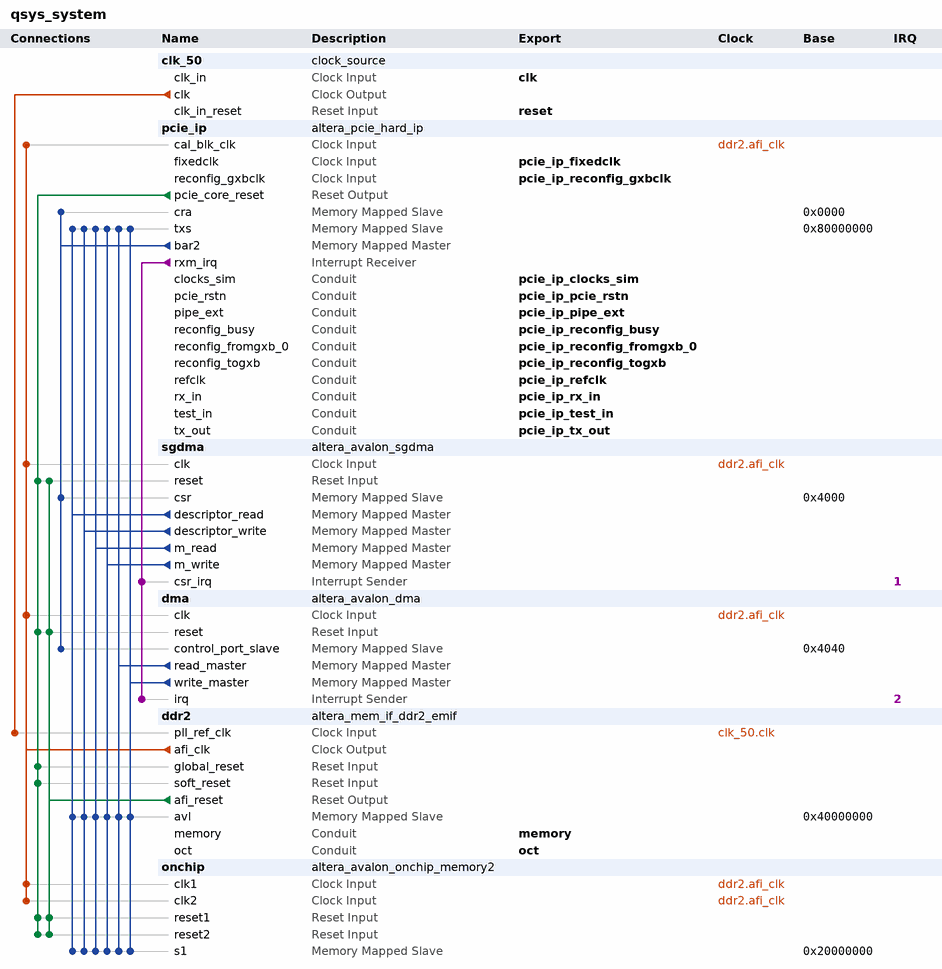
[diagram p0: system contents]
# Platform Designer (Qsys) system qsys_system, Stratix IV EP4SGX530KH40C2
# Parameters at their usual value, and those the tool derives, are not listed.
package require -exact qsys 14.0
create_system qsys_system
set_project_property DEVICE_FAMILY {Stratix IV}
set_project_property DEVICE EP4SGX530KH40C2

add_instance clk_50 clock_source 14.0
set_instance_parameter_value clk_50 clockFrequency 50000000

add_instance pcie_ip altera_pcie_hard_ip 14.0
set_instance_parameter_value pcie_ip max_link_width 4
set_instance_parameter_value pcie_ip p_pcie_test_out_width None
set_instance_parameter_value pcie_ip {BAR Type} {32 bit Non-Prefetchable,Not used,32 bit Non-Prefetchable,Not used,Not used,Not used}
set_instance_parameter_value pcie_ip vendor_id 4466
set_instance_parameter_value pcie_ip device_id 3556
set_instance_parameter_value pcie_ip class_code 0
set_instance_parameter_value pcie_ip subsystem_vendor_id 4466
set_instance_parameter_value pcie_ip subsystem_device_id 4
set_instance_parameter_value pcie_ip my_advanced_errors false
set_instance_parameter_value pcie_ip my_enable_ecrc_check false
set_instance_parameter_value pcie_ip my_enable_ecrc_gen false
set_instance_parameter_value pcie_ip CG_NO_CPL_REORDERING 0
set_instance_parameter_value pcie_ip CG_ENABLE_A2P_INTERRUPT 0
set_instance_parameter_value pcie_ip p_user_msi_enable 0
set_instance_parameter_value pcie_ip CB_A2P_ADDR_MAP_PASS_THRU_BITS 31
set_instance_parameter_value pcie_ip {PCIe Address 63:32} 0x00000000,0x00000000,0x00000000,0x00000000,0x00000000,0x00000000,0x00000000,0x00000000,0x00000000,0x00000000,0x00000000,0x00000000,0x00000000,0x00000000,0x00000000,0x00000000
set_instance_parameter_value pcie_ip {PCIe Address 31:0} 0x00000000,0x00000000,0x00000000,0x00000000,0x00000000,0x00000000,0x00000000,0x00000000,0x00000000,0x00000000,0x00000000,0x00000000,0x00000000,0x00000000,0x00000000,0x00000000

add_instance sgdma altera_avalon_sgdma 14.0
set_instance_parameter_value sgdma enableBurstTransfers true
set_instance_parameter_value sgdma enableUnalignedTransfers false
set_instance_parameter_value sgdma readBlockDataWidth 64
set_instance_parameter_value sgdma readBurstcountWidth 8
set_instance_parameter_value sgdma sinkErrorWidth 0
set_instance_parameter_value sgdma sourceErrorWidth 0
set_instance_parameter_value sgdma transferMode MEMORY_TO_MEMORY
set_instance_parameter_value sgdma writeBurstcountWidth 8

add_instance dma altera_avalon_dma 14.0
set_instance_parameter_value dma allowByteTransactions false
set_instance_parameter_value dma allowDoubleWordTransactions true
set_instance_parameter_value dma allowHalfWordTransactions false
set_instance_parameter_value dma allowQuadWordTransactions false
set_instance_parameter_value dma allowWordTransactions false
set_instance_parameter_value dma burstEnable true
set_instance_parameter_value dma fifoDepth 4096
set_instance_parameter_value dma maxBurstSize 1024
set_instance_parameter_value dma minimumDmaTransactionRegisterWidth 14

add_instance ddr2 altera_mem_if_ddr2_emif 14.0
set_instance_parameter_value ddr2 MEM_CLK_FREQ 400.0
set_instance_parameter_value ddr2 MEM_VENDOR Hynix
set_instance_parameter_value ddr2 MEM_ROW_ADDR_WIDTH 14
set_instance_parameter_value ddr2 MEM_COL_ADDR_WIDTH 10
set_instance_parameter_value ddr2 MEM_DQ_WIDTH 64
set_instance_parameter_value ddr2 MEM_BANKADDR_WIDTH 3
set_instance_parameter_value ddr2 MEM_NUMBER_OF_RANKS_PER_DIMM 1
set_instance_parameter_value ddr2 MEM_CK_WIDTH 3
set_instance_parameter_value ddr2 MEM_RTT_NOM 75
set_instance_parameter_value ddr2 MEM_TCL 6
set_instance_parameter_value ddr2 TIMING_TIS 175
set_instance_parameter_value ddr2 TIMING_TIH 250
set_instance_parameter_value ddr2 TIMING_TDS 50
set_instance_parameter_value ddr2 TIMING_TDH 125
set_instance_parameter_value ddr2 TIMING_TDQSQ 120
set_instance_parameter_value ddr2 TIMING_TQHS 300
set_instance_parameter_value ddr2 TIMING_TDQSCK 400
set_instance_parameter_value ddr2 MEM_TINIT_US 499
set_instance_parameter_value ddr2 MEM_TMRD_CK 3
set_instance_parameter_value ddr2 MEM_TRAS_NS 40.0
set_instance_parameter_value ddr2 MEM_TREFI_US 7.0
set_instance_parameter_value ddr2 MEM_TRFC_NS 75.0
set_instance_parameter_value ddr2 MEM_TWTR 2
set_instance_parameter_value ddr2 POWER_OF_TWO_BUS false
set_instance_parameter_value ddr2 AVL_MAX_SIZE 64
set_instance_parameter_value ddr2 REF_CLK_FREQ 50.0
set_instance_parameter_value ddr2 PLL_SHARING_MODE None
set_instance_parameter_value ddr2 EXPORT_AFI_HALF_CLK false
set_instance_parameter_value ddr2 ADVANCED_CK_PHASES true
set_instance_parameter_value ddr2 COMMAND_PHASE -20.0
set_instance_parameter_value ddr2 CALIBRATION_MODE Skip
set_instance_parameter_value ddr2 USER_DEBUG_LEVEL 1
set_instance_parameter_value ddr2 TIMING_BOARD_AC_TO_CK_SKEW 0.0
set_instance_parameter_value ddr2 DLL_SHARING_MODE None

add_instance onchip altera_avalon_onchip_memory2 14.0
set_instance_parameter_value onchip dataWidth 64
set_instance_parameter_value onchip dualPort true
set_instance_parameter_value onchip initMemContent true
set_instance_parameter_value onchip initializationFileName onchip_mem.hex
set_instance_parameter_value onchip memorySize 786432

# connections
add_connection clk_50.clk ddr2.pll_ref_clk clock
add_connection ddr2.afi_clk dma.clk clock
add_connection ddr2.afi_clk onchip.clk1 clock
add_connection ddr2.afi_clk onchip.clk2 clock
add_connection ddr2.afi_clk pcie_ip.cal_blk_clk clock
add_connection ddr2.afi_clk sgdma.clk clock
add_connection ddr2.afi_reset dma.reset reset
add_connection ddr2.afi_reset onchip.reset1 reset
add_connection ddr2.afi_reset onchip.reset2 reset
add_connection ddr2.afi_reset sgdma.reset reset
add_connection pcie_ip.pcie_core_reset ddr2.global_reset reset
add_connection pcie_ip.pcie_core_reset ddr2.soft_reset reset
add_connection pcie_ip.pcie_core_reset dma.reset reset
add_connection pcie_ip.pcie_core_reset onchip.reset1 reset
add_connection pcie_ip.pcie_core_reset onchip.reset2 reset
add_connection pcie_ip.pcie_core_reset sgdma.reset reset
add_connection dma.read_master ddr2.avl avalon
set_connection_parameter_value dma.read_master/ddr2.avl baseAddress 0x40000000
add_connection dma.read_master onchip.s1 avalon
set_connection_parameter_value dma.read_master/onchip.s1 baseAddress 0x20000000
add_connection dma.read_master pcie_ip.txs avalon
set_connection_parameter_value dma.read_master/pcie_ip.txs baseAddress 0x80000000
add_connection dma.write_master ddr2.avl avalon
set_connection_parameter_value dma.write_master/ddr2.avl baseAddress 0x40000000
add_connection dma.write_master onchip.s1 avalon
set_connection_parameter_value dma.write_master/onchip.s1 baseAddress 0x20000000
add_connection dma.write_master pcie_ip.txs avalon
set_connection_parameter_value dma.write_master/pcie_ip.txs baseAddress 0x80000000
add_connection pcie_ip.bar2 dma.control_port_slave avalon
set_connection_parameter_value pcie_ip.bar2/dma.control_port_slave baseAddress 0x4040
add_connection pcie_ip.bar2 pcie_ip.cra avalon
set_connection_parameter_value pcie_ip.bar2/pcie_ip.cra baseAddress 0x0000
add_connection pcie_ip.bar2 sgdma.csr avalon
set_connection_parameter_value pcie_ip.bar2/sgdma.csr baseAddress 0x4000
add_connection sgdma.descriptor_read ddr2.avl avalon
set_connection_parameter_value sgdma.descriptor_read/ddr2.avl baseAddress 0x40000000
add_connection sgdma.descriptor_read onchip.s1 avalon
set_connection_parameter_value sgdma.descriptor_read/onchip.s1 baseAddress 0x20000000
add_connection sgdma.descriptor_read pcie_ip.txs avalon
set_connection_parameter_value sgdma.descriptor_read/pcie_ip.txs baseAddress 0x80000000
add_connection sgdma.descriptor_write ddr2.avl avalon
set_connection_parameter_value sgdma.descriptor_write/ddr2.avl baseAddress 0x40000000
add_connection sgdma.descriptor_write onchip.s1 avalon
set_connection_parameter_value sgdma.descriptor_write/onchip.s1 baseAddress 0x20000000
add_connection sgdma.descriptor_write pcie_ip.txs avalon
set_connection_parameter_value sgdma.descriptor_write/pcie_ip.txs baseAddress 0x80000000
add_connection sgdma.m_read ddr2.avl avalon
set_connection_parameter_value sgdma.m_read/ddr2.avl baseAddress 0x40000000
add_connection sgdma.m_read onchip.s1 avalon
set_connection_parameter_value sgdma.m_read/onchip.s1 baseAddress 0x20000000
add_connection sgdma.m_read pcie_ip.txs avalon
set_connection_parameter_value sgdma.m_read/pcie_ip.txs baseAddress 0x80000000
add_connection sgdma.m_write ddr2.avl avalon
set_connection_parameter_value sgdma.m_write/ddr2.avl baseAddress 0x40000000
add_connection sgdma.m_write onchip.s1 avalon
set_connection_parameter_value sgdma.m_write/onchip.s1 baseAddress 0x20000000
add_connection sgdma.m_write pcie_ip.txs avalon
set_connection_parameter_value sgdma.m_write/pcie_ip.txs baseAddress 0x80000000
add_connection pcie_ip.rxm_irq dma.irq interrupt
set_connection_parameter_value pcie_ip.rxm_irq/dma.irq irqNumber 2
add_connection pcie_ip.rxm_irq sgdma.csr_irq interrupt
set_connection_parameter_value pcie_ip.rxm_irq/sgdma.csr_irq irqNumber 1

# exported interfaces
add_interface pcie_ip_refclk conduit end
set_interface_property pcie_ip_refclk EXPORT_OF pcie_ip.refclk
add_interface pcie_ip_test_in conduit end
set_interface_property pcie_ip_test_in EXPORT_OF pcie_ip.test_in
add_interface pcie_ip_pcie_rstn conduit end
set_interface_property pcie_ip_pcie_rstn EXPORT_OF pcie_ip.pcie_rstn
add_interface pcie_ip_clocks_sim conduit end
set_interface_property pcie_ip_clocks_sim EXPORT_OF pcie_ip.clocks_sim
add_interface pcie_ip_reconfig_busy conduit end
set_interface_property pcie_ip_reconfig_busy EXPORT_OF pcie_ip.reconfig_busy
add_interface pcie_ip_pipe_ext conduit end
set_interface_property pcie_ip_pipe_ext EXPORT_OF pcie_ip.pipe_ext
add_interface pcie_ip_rx_in conduit end
set_interface_property pcie_ip_rx_in EXPORT_OF pcie_ip.rx_in
add_interface pcie_ip_reconfig_togxb conduit end
set_interface_property pcie_ip_reconfig_togxb EXPORT_OF pcie_ip.reconfig_togxb
add_interface pcie_ip_tx_out conduit end
set_interface_property pcie_ip_tx_out EXPORT_OF pcie_ip.tx_out
add_interface pcie_ip_reconfig_gxbclk clock sink
set_interface_property pcie_ip_reconfig_gxbclk EXPORT_OF pcie_ip.reconfig_gxbclk
add_interface pcie_ip_reconfig_fromgxb_0 conduit end
set_interface_property pcie_ip_reconfig_fromgxb_0 EXPORT_OF pcie_ip.reconfig_fromgxb_0
add_interface clk clock sink
set_interface_property clk EXPORT_OF clk_50.clk_in
add_interface reset reset sink
set_interface_property reset EXPORT_OF clk_50.clk_in_reset
add_interface pcie_ip_fixedclk clock sink
set_interface_property pcie_ip_fixedclk EXPORT_OF pcie_ip.fixedclk
add_interface memory conduit end
set_interface_property memory EXPORT_OF ddr2.memory
add_interface oct conduit end
set_interface_property oct EXPORT_OF ddr2.oct

set_interconnect_requirement {$system} qsys_mm.clockCrossingAdapter HANDSHAKE
set_interconnect_requirement {$system} qsys_mm.maxAdditionalLatency 1

save_system qsys_system.qsys
